# EAGLE schematic controlador (EAGLE 7.3.0)
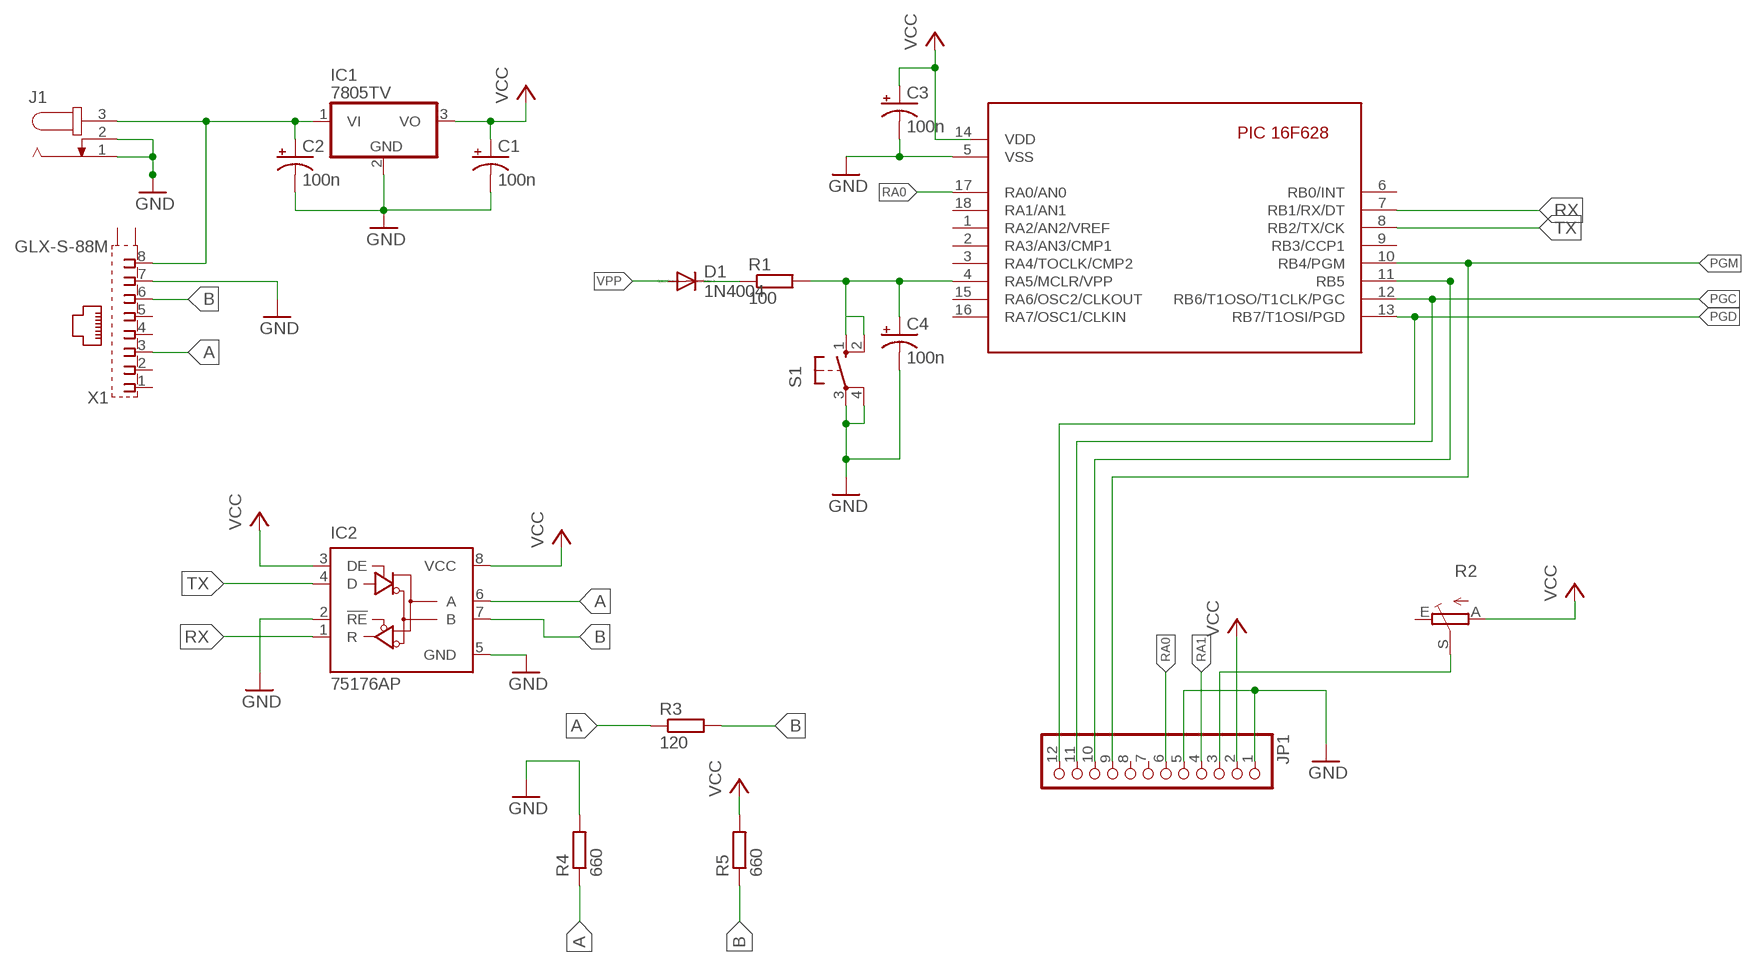
[diagram p0: schematic, sheet 1]

## Parts
C1  100n  CPOL-USE2.5-5  [E2,5-5]
C2  100n  CPOL-USE2.5-5  [E2,5-5]
C3  100n  CPOL-USE2.5-5  [E2,5-5]
C4  100n  CPOL-USE2.5-5  [E2,5-5]
D1  1N4004  [DO41-10]
IC1  7805TV  [TO220V]
IC2  75176AP  [DIL08]
J1  JACK-PLUG1  [SPC4078]
JP1  PINHD-1X12  [1X12]
R1  100  R-EU_0204/7  [0204/7]
R2  TRIM_EU-B25P  [B25P]
R3  120  R-EU_0204/7  [0204/7]
R4  660  R-EU_0204/7  [0204/7]
R5  660  R-EU_0204/7  [0204/7]
S1  10-XX  [B3F-10XX]
U$1  16F628  [PIC16F628-18-LEAD-PDIP]
X1  GLX-S-88M  [GLX-S-88M]

## Nets
A: IC2.6(A) R3.1 R4.1 X1.3
B: IC2.7(B) R3.2 R5.1 X1.6
GND: C1.- C2.- C3.- C4.- IC1.2(GND) IC2.2(!RE) IC2.5(GND) J1.1 J1.2 JP1.1 JP1.5 R4.2 S1.3(P) S1.4(P1) U$1.5(VSS) X1.7
N$1: C2.+ IC1.1(VI) J1.3 X1.8
N$2: D1.C R1.1
N$3: JP1.3 R2.S
N$5: JP1.10 U$1.11(RB5)
PGC: JP1.11 U$1.12(RB6/T1OSO/T1CLK/PGC)
PGD: JP1.12 U$1.13(RB7/T1OSI/PGD)
PGM: JP1.9 U$1.10(RB4/PGM)
RA0: JP1.6 U$1.17(RA0/AN0)
RA1: JP1.4
RX: IC2.1(R) U$1.7(RB1/RX/DT)
TX: IC2.4(D) U$1.8(RB2/TX/CK)
VCC: C1.+ C3.+ IC1.3(VO) IC2.3(DE) IC2.8(VCC) JP1.2 R2.A R5.2 U$1.14(VDD)
VPP: C4.+ D1.A R1.2 S1.1(S) S1.2(S1) U$1.4(RA5/MCLR/VPP)
Unconnected: JP1.7 JP1.8 R2.E U$1.1(RA2/AN2/VREF) U$1.2(RA3/AN3/CMP1) U$1.3(RA4/TOCLK/CMP2) U$1.6(RB0/INT) U$1.9(RB3/CCP1) U$1.15(RA6/OSC2/CLKOUT) U$1.16(RA7/OSC1/CLKIN) U$1.18(RA1/AN1) X1.1 X1.2 X1.4 X1.5 X1.S1 X1.S2

## Library data of the parts
C1-C4 = rcl:CPOL-US: POLARIZED CAPACITOR, American symbol
D1 = diode:1N4004: DIODE general purpose rectifier, 1 A
IC1 = linear:78*: Positive VOLTAGE REGULATOR Source: http://cache.national.com/ds/LM/LM78L05.pdf http://www.fairchildsemi.com/ds/LM/LM7805.pdf
IC2 = 751xx:75176A: DIFFERENTIAL BUS TRANSCEIVER Source: http://focus.ti.com/lit/ds/symlink/sn75176a.pdf
J1 = con-jack:JACK-PLUG: DC POWER JACK Power Jack, DC, Right Angle, Through Hole, Rated 5A at 16VDC, PC Terminals Distributor: Farnell (www.Farnell.de) Drawing: 84N1161.pdf / 84N1162.pdf Manufacturer: SPC Technology (www.spctechnology.com) Type: SPC4077 / SPC 4078; OC_FARNELL: unknown; OC_NEWARK: unknown
JP1 = pinhead:PINHD-1X12: PIN HEADER
R1 R3-R5 = resistor:R-EU_: RESISTOR, European symbol
R2 = pot:TRIM_EU-: POTENTIOMETER
S1 = switch-omron:10-XX: OMRON SWITCH; MPN: B3F-1000; OC_FARNELL: 176432; OC_NEWARK: 36M3542
U$1 = pic16f6xx:16F628: Microchip component PIC 16F628 Eric Magraner - eric_magraner@yahoo.fr 03/2004
X1 = con-kycon:GLX-S-88M: Mod. Jack, Right Angle, 8 posiotion, 8 contatcs RJ45 Source: GLX-S-88M.pdf; OC_FARNELL: unknown; OC_NEWARK: unknown